# EAGLE schematic EE-SX1131 (EAGLE 6.4)
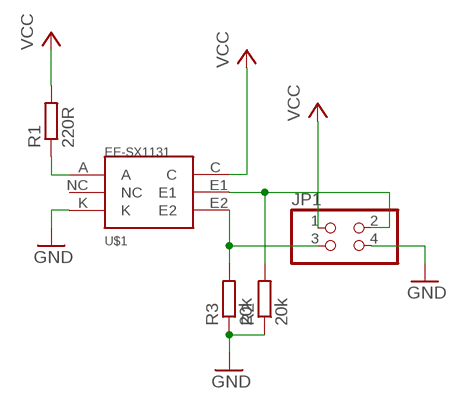
[diagram p0: schematic, sheet 1]

## Parts
JP1  PINHD-2X2  [2X02]
R1  220R  R-EU_M0805  [M0805]
R2  20k  R-EU_M0805  [M0805]
R3  20k  R-EU_M0805  [M0805]
U$1  EE-SX1131  [EE-SX1131]

## Nets
GND: JP1.4 R2.1 R3.1 U$1.K
N$1: R1.1 U$1.A
N$2: JP1.3 R3.2 U$1.E2
N$3: JP1.2 R2.2 U$1.E1
VCC: JP1.1 R1.2 U$1.C
Unconnected: U$1.NC

## Library data of the parts
JP1 = pinhead:PINHD-2X2: PIN HEADER
R1-R3 = rcl:R-EU_: RESISTOR, European symbol
U$1 = BEEP:EE-SX1131